# Altium schematic sheet STM32.SchDoc
size A; SheetNumber: 6; SheetTotal: 8
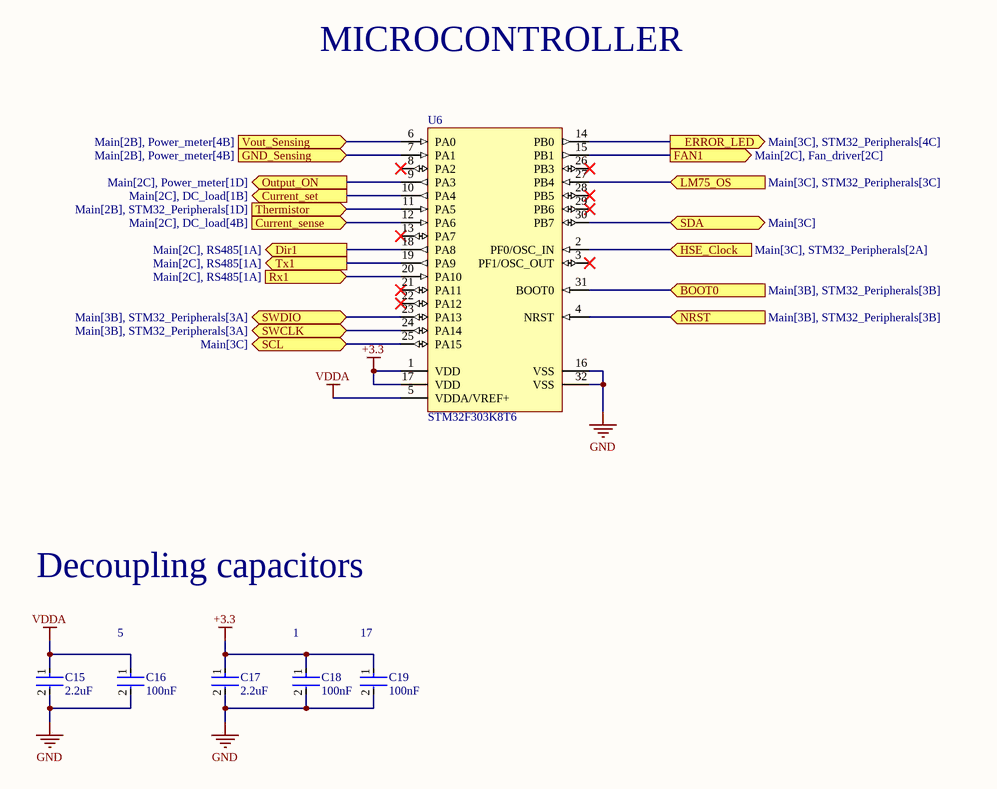
[diagram p0: STM32.SchDoc]

## Parts
C15  2.2uF  [FP-0805-L_2_01_0_2-W_1_25-IPC_B]
C16  100nF  [FP-CGA3E-0_3-0_1-IPC_A]
C17  2.2uF  [FP-0805-L_2_01_0_2-W_1_25-IPC_B]
C18  100nF  [FP-CGA3E-0_3-0_1-IPC_A]
C19  100nF  [FP-CGA3E-0_3-0_1-IPC_A]
U6  STM32F303K8T6  [STM-LQFP32_M]

## Ports
BOOT0 (in, see Main[3B], STM32_Peripherals[3B]), Current_sense (in, see Main[2C], DC_load[4B]), Current_set (out, see Main[2C], DC_load[1B]), Dir1 (out, see Main[2C], RS485[1A]), ERROR_LED (out, see Main[3C], STM32_Peripherals[4C]), FAN1 (out, see Main[2C], Fan_driver[2C]), GND_Sensing (in, see Main[2B], Power_meter[4B]), HSE_Clock (in, see Main[3C], STM32_Peripherals[2A]), LM75_OS (in, see Main[3C], STM32_Peripherals[3C]), NRST (in, see Main[3B], STM32_Peripherals[3B]), Output_ON (out, see Main[2C], Power_meter[1D]), Rx1 (in, see Main[2C], RS485[1A]), SCL (bidir, see Main[3C]), SDA (bidir, see Main[3C]), SWCLK (bidir, see Main[3B], STM32_Peripherals[3A]), SWDIO (bidir, see Main[3B], STM32_Peripherals[3A]), Thermistor (in, see Main[2B], STM32_Peripherals[1D]), Tx1 (out, see Main[2C], RS485[1A]), Vout_Sensing (in, see Main[2B], Power_meter[4B])

## Nets
+3.3: C17.1 C18.1 C19.1 U6.1(VDD) U6.17(VDD)
GND: C15.2 C16.2 C17.2 C18.2 C19.2 U6.16(VSS) U6.32(VSS)
VDDA: C15.1 C16.1 U6.5(VDDA/VREF+)
BOOT0: U6.31(BOOT0) ; port BOOT0
Current_sense: U6.12(PA6) ; port Current_sense
Current_set: U6.10(PA4) ; port Current_set
Dir1: U6.18(PA8) ; port Dir1
ERROR_LED: U6.14(PB0) ; port ERROR_LED
FAN1: U6.15(PB1) ; port FAN1
GND_Sensing: U6.7(PA1) ; port GND_Sensing
HSE_Clock: U6.2(PF0/OSC_IN) ; port HSE_Clock
LM75_OS: U6.27(PB4) ; port LM75_OS
NRST: U6.4(NRST) ; port NRST
Output_ON: U6.9(PA3) ; port Output_ON
Rx1: U6.20(PA10) ; port Rx1
SCL: U6.25(PA15) ; port SCL
SDA: U6.30(PB7) ; port SDA
SWCLK: U6.24(PA14) ; port SWCLK
SWDIO: U6.23(PA13) ; port SWDIO
Thermistor: U6.11(PA5) ; port Thermistor
Tx1: U6.19(PA9) ; port Tx1
Vout_Sensing: U6.6(PA0) ; port Vout_Sensing

Not connected (* = marked no-connect by the designer): U6 3(PF1/OSC_OUT)* 8(PA2)* 13(PA7)* 21(PA11)* 22(PA12)* 26(PB3)* 28(PB5)* 29(PB6)*

## Notes on the sheet
- MICROCONTROLLER
- Decoupling capacitors
- (near C16) 5
- (near C18) 1
- (near C19) 17

## Library data of the parts
C15 C17 = CMP-2007-04174-2: General Purpose Ceramic Capacitor, 0805, 10nF, 10%, X7R, 15%, 100V; Capacitance: 100nF; Packaging: Tape and Reel; Min Operating Temperature: -55°C; Dielectric Material: Ceramic; Height: 1.4mm; Voltage Rating: 100V; Termination: SMD/SMT; Case Code (Imperial): 0805; Case Code (Metric): 2012; Case/Package: 0805; Construction: Flat; Radiation Hardening: No; Series: -; Dielectric: X7R; Package Quantity: 2000; Mount: Surface Mount; Contact Plating: Tin; Voltage: 100V; Lead Free: Lead Free; Depth: 1.25mm; RoHS Compliant: Yes; Number of Pins: 2; Max Operating Temperature: 125°C; Length: 2.01mm; Voltage Rating (DC): 100V; Thickness: 0.055inch; REACH SVHC: No SVHC; Width: 0.049inch; Tolerance: 10%
C16 C18 C19 = CMP-2000-07546-2: Cap Ceramic 100nF 50V X7R 10% Pad SMD 0603 +125°C Automotive T/R; Weight: 7.1E-05oz; Composition: Ceramic; Max Operating Temperature: 125°C; Termination: SMD/SMT; Dielectric: X7R; Length: 1.6mm; Package Quantity: 1; REACH SVHC: No SVHC; Lead Free: Lead Free; Case Code (Metric): 1608; Min Operating Temperature: -55°C; Packaging: Tape and Reel; Tolerance: 10%; Voltage Rating: 50V; Case Code (Imperial): 0603; Capacitance: 100nF; Case/Package: 0603; Voltage Rating (DC): 50V; Depth: 0.8mm; Radiation Hardening: No; Ratings: AEC-Q200; Mount: Surface Mount; Voltage: 50V; Thickness: 0.035inch; Width: 0.8mm; Height: 0.8mm
U6 = CMP-0537-00040-1: ARM Cortex-M4 32-bit MCU, 64 KB Flash, 16 KB Internal RAM, 25 I/Os, 32-Pin LQFP, -40 to 85 degC, Tray; Supply Voltage(Vcc) min (V): 2; Internal RAM Size (kB): 16; D/A Converter: 3; FLASH Size (Prog) (kB): 64; I/Os (High Current): 25; Operating Frequency(F) (Processor speed) (MHz): 72; ComponentLink1URL: http://www.st.com/; Package Description: 32-Pin Low Profile Quad Flat Package, 7 x 7 mm Body, 0.8 mm Pitch; Mounting Technology: Surface Mount; ComponentLink2Description: Datasheet; ComponentLink2URL: http://www.st.com/st-web-ui/static/active/en/resource/technical/document/datasheet/DM00092070.pdf; Core: ARM Cortex-M4; ComponentLink1Description: Manufacturer URL; Package Reference: LQFP32; Packing: Tray; DatasheetVersion: Rev. 4